# Altium schematic sheet ADF_1st_mixer_TX.SchDoc
size A4
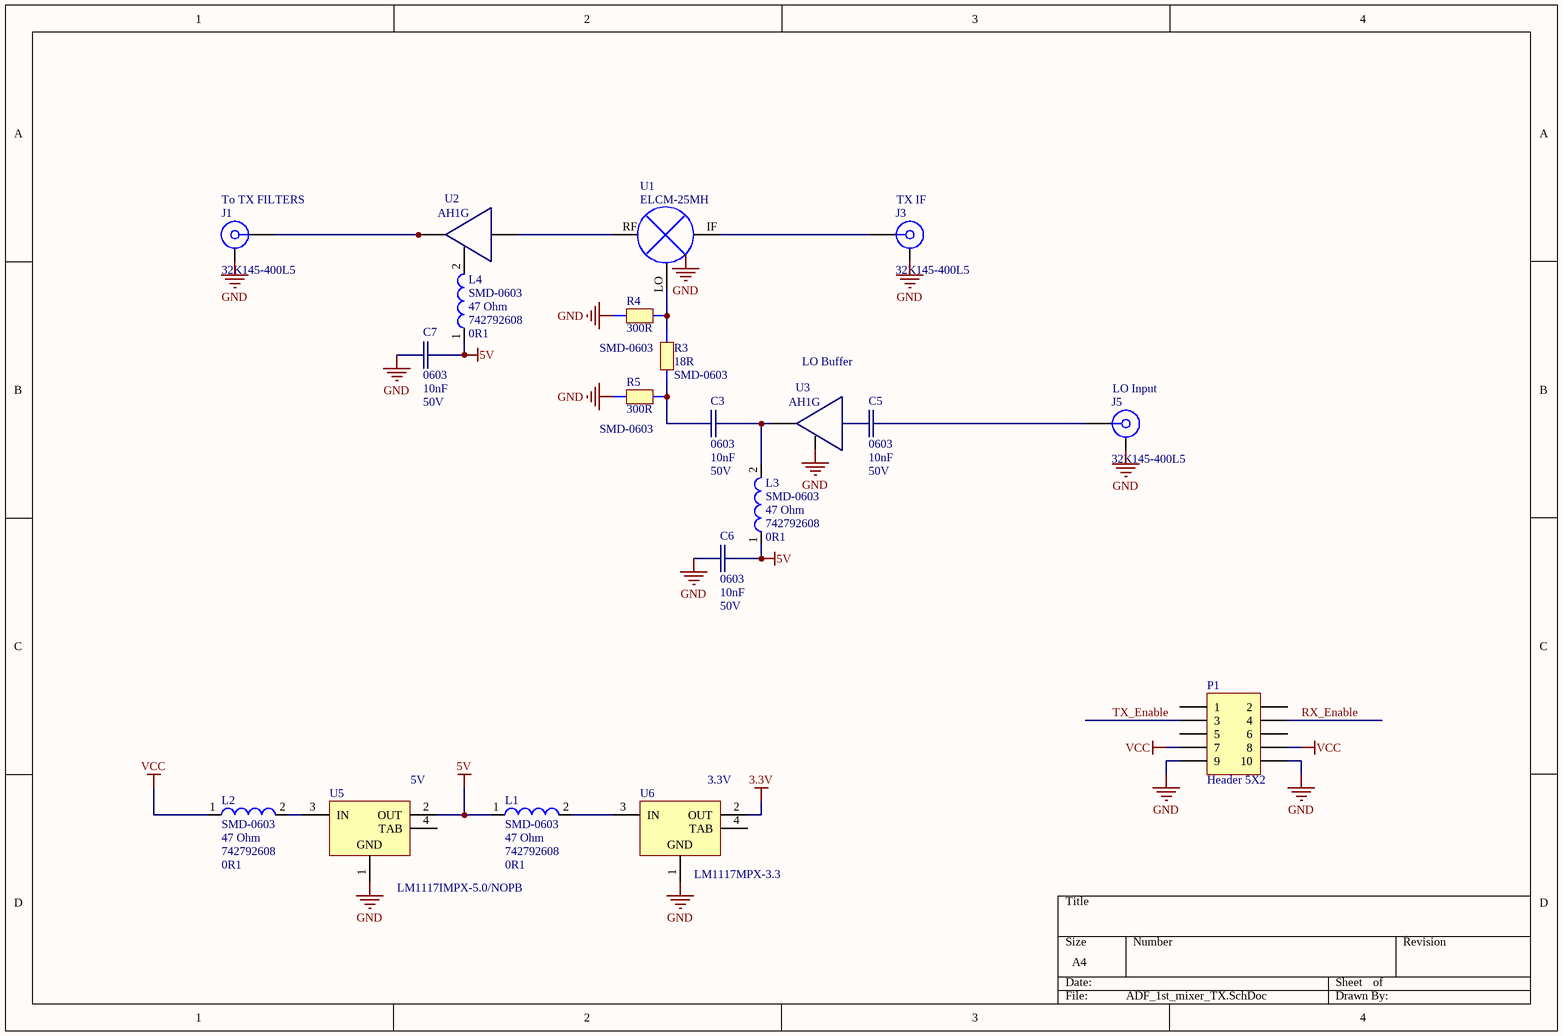
[diagram p0: ADF_1st_mixer_TX.SchDoc]

## Parts
C3  Case Code (Imperial): 0603  Capacitance: 10nF  Voltage: 50V  [C0603_murata]  (hidden comment: 10nF 0603 NP0)
C5  Case Code (Imperial): 0603  Capacitance: 10nF  Voltage: 50V  [C0603_murata]  (hidden comment: 10nF 0603 NP0)
C6  Case Code (Imperial): 0603  Capacitance: 10nF  Voltage: 50V  [C0603_murata]  (hidden comment: 10nF 0603 NP0)
C7  Case Code (Imperial): 0603  Capacitance: 10nF  Voltage: 50V  [C0603_murata]  (hidden comment: 10nF 0603 NP0)
J1  32K145-400L5  [ROS-32K145-400L5_V]
J3  32K145-400L5  [ROS-32K145-400L5_V]
J5  32K145-400L5  [ROS-32K145-400L5_V]
L1  Impedance: 47 Ohm  DC_Resistance: 0R1  [SMD-0603]  (hidden comment: 742792608)
L2  Impedance: 47 Ohm  DC_Resistance: 0R1  [SMD-0603]  (hidden comment: 742792608)
L3  Impedance: 47 Ohm  DC_Resistance: 0R1  [SMD-0603]  (hidden comment: 742792608)
L4  Impedance: 47 Ohm  DC_Resistance: 0R1  [SMD-0603]  (hidden comment: 742792608)
P1  Header 5X2  [HDR2X5]
R3  value 18R  PackageReference: SMD-0603  [RESC1608X06N_0603]  (hidden comment: Resistor)
R4  value 300R  PackageReference: SMD-0603  [RESC1608X06N_0603]  (hidden comment: Resistor)
R5  value 300R  PackageReference: SMD-0603  [RESC1608X06N_0603]  (hidden comment: Resistor)
U1  ELCM-25MH  [SM-87]
U2  AH1G  [SOT-89]
U3  AH1G  [SOT-89]
U5  LM1117IMPX-5.0/NOPB  [MP04A_M]
U6  LM1117MPX-3.3  [DCY0004A_N]

## Nets
3.3V: U6.2(OUT)
5V: C6.2 C7.2 L1.1 L3.1 L4.1 U5.2(OUT)
GND: C6.1 C7.1 J1.MP J3.MP J5.MP P1.9 P1.10 R4.2 R5.2 U1.GND U3.2 U5.1(GND) U6.1(GND)
VCC: L2.1 P1.7 P1.8
RX_Enable: P1.4
TX_Enable: P1.3
NetC3_1: C3.1 R3.1 R5.1
NetC3_2: C3.2 L3.2 U3.3
NetC5_1: C5.1 U3.1
NetC5_2: C5.2 J5.1
NetJ1_1: J1.1 U2.3
NetJ3_1: J3.1 U1.IF
NetL1_2: L1.2 U6.3(IN)
NetL2_2: L2.2 U5.3(IN)
NetL4_2: L4.2 U2.2
NetR3_2: R3.2 R4.1 U1.LO

Not connected (* = marked no-connect by the designer): P1 1 2 5 6; U1 RF; U2 1; U5 4(TAB); U6 4(TAB)

## Notes on the sheet
- (near J1) To TX FILTERS
- (near J3) TX IF
- LO Buffer
- (near J5) LO Input
- (near U5) 5V
- (near U6) 3.3V

## Library data of the parts
C3 C5-C7 = 10nF 0603 NP0: 10nF 0603 NP0 muRata; Manufacturer Part Number 1: GRM1885C1H103JA01D; Material: Ceramic; Tolerance: 5%; Dielectric: C0G; Supplier 1: Mouser; Manufacturer 1: Murata; Stock 1: 5; Pricing 1: 1=0.13, 10=0.05, 50=0.05, 100=0.035, 1000=0.024, 10000=0.016 (USD); Case/Package: 0603; Case Code (Metric): 1608; Min Operating Temperature: -55°C; Max Operating Temperature: 125°C; Packaging: Tape and Reel; Package Quantity: 4000; Voltage Rating: 50V; Voltage Rating (DC): 50V; Termination: SMD/SMT; Length: 1.6mm; Height: 0.8mm; Width: 0.8mm; Thickness: 0.035inch; Lead Pitch: 0.5mm; Depth: 0.8mm; REACH SVHC: No SVHC; Lead Free: Lead Free; ComponentLink1URL: https://datasheet.ciiva.com/41860/partnumbering-e-01-41860759.pdf; ComponentLink1Description: https://datasheet.ciiva.com/41860/partnumbering-e-01-41860759.pdf; ComponentLink2URL: https://datasheet.ciiva.com/29537/partnumbering-e-01-29537910.pdf; ComponentLink2Description: https://datasheet.ciiva.com/29537/partnumbering-e-01-29537910.pdf; Supplier Part Number 1: 81-GRM1885C1H103JA1D
J1 J3 J5 = 32K145-400L5: SMA Right Angle Jack, Edge Mount, Up to 18 GHz, -55 to 155 degC; Design Note 1: Footprint in library is a generic example - only application specific footprint delivers High Performance; Desgin Note 2: For more information about DRC setting, please look at following webpage, http://techdocs.altium.com/display/SCRT/Design+Rule+for+Edge-Mount+Connectors; DatasheetVersion: b00; PackageVersion: b00; PackageReference: 32K145-400L5; PackageDescription: SMA Right Angle Jack, Edge Mount, 14.25 x 9.5 x 4.46 mm; Mounting Technology: Surface Mount; PartNumber: 32K145-400L5; ComponentLink1Description: Manufacturer URL; ComponentLink1URL: http://www.rosenberger.de; ComponentLink2Description: Datasheet; ComponentLink2URL: http://rosenberger.de/ok/images/documents/db/32K145-400L5.pdf; ComponentLink3Description: Package Specification; ComponentLink3URL: http://rosenberger.de/ok/images/documents/db/32K145-400L5.pdf; ComponentLink4Description: Series Overview / Design Note; ComponentLink4URL: http://rosenberger.de/ok/images/documents/spez/32.pdf; ComponentLink5Description: Webshop / RFQ; ComponentLink5URL: http://www.rosenberger.com/en/contact/sales/
L1-L4 = 742792608: SMD EMI Suppression Ferrite Bead WE-CBF, Z = 47 Ohm; Seller: Farnell; OrderCode: 1635681RL; DatasheetVersion: Dec-2005; PackageVersion: 2009; PackageDescription: Chip Inductor, 2-Leads, Body 1.6 x 0.8 mm; ComponentLink1Description: Manufacturer URL; ComponentLink1URL: http://www.we-online.com; ComponentLink2Description: Datasheet; ComponentLink2URL: http://www.we-online.de/katalog/media/pdf/742792608.pdf; PackageReference: SMD-0603; Value: 742792608
P1 = Header 5X2: Header, 5-Pin, Dual row; LatestRevisionDate: 17-Jul-2002; LatestRevisionNote: Re-released for DXP Platform.; Publisher: Altium Limited
R3-R5 = Resistor_0R_0603_Bulk: Bulk SMD Resistor; Manufacturer: PANASONIC; ManufacturerRef: ERJ3GEY0R00V; Seller: Farnell; Voltage: 75V; PowerRating: 100mW; OrderCode: 2059527RL; TemperatureCoeff: ± 200ppm/°C; Type: Thick Film; PriceEuro: 0.005; PackageDescription: SMD; Published: 15.5.2014; Publisher: atr; Tolerance: -
U1 = ELCM-25MH: Manufacturer 1: TE Connectivity MA-COM; Manufacturer Part Number 1: ELCM-25MHTR; LO Drive: +13dBm; RF Power: +9dBm; Supplier 1: Avnet; Stock 1: 0; ComponentLink1URL: http://www.macomtech.com/DataSheets/ELCM-25MH.pdf; ComponentLink1Description: http://www.macomtech.com/DataSheets/ELCM-25MH.pdf; Supplier Part Number 1: ELCM-25MH
U2 U3 = AH1G: 250-4000MHz MMIC; Manufacturer 1: TriQuint; Manufacturer Part Number 1: AH1; Frequency: 4GHz; Number of Channels: 1; Supply Voltage: 5V; Gain: 13.5dB; P1dB: +22dBm; Supplier 1: Newark; Stock 1: 0; Pricing 1: 1=37.74, 25=34.58, 50=32.12, 100=31.07, 250=30.01 (USD); Mount: Surface Mount; Case/Package: SOT-89; Radiation Hardening: No; ComponentLink1URL: https://www.verical.com/server-webapp/html/getDatasheet?partID=559390; ComponentLink1Description: https://www.verical.com/server-webapp/html/getDatasheet?partID=559390; Supplier Part Number 1: 15B6194
U5 = CMP-0062-01628-3: 800mA Low-Dropout Linear Regulator, 4-pin SOT-223, Pb-Free; Manufacturer: National Semiconductor; CompType: LDO IC; High-Reliability: Y; PackageTopMarking: XYTT*N06B; PowerWise: N; ComponentLink3Description: LM1117 Web Page; ComponentLink3URL: http://www.national.com/pf/LM/LM1117.html; DatasheetVersion: Apr-2006; ComponentLink2Description: LM1117 Datasheet; PackageVersion: revB, Apr-2003; ComponentLink4Description: MP04A Package Page; ComponentLink1Description: Manufacturer URL; PartNumber: LM1117IMPX-5.0/NOPB; ComponentLink1URL: http://www.national.com/; PackageReference: MP04A; ComponentLink2URL: http://www.national.com/ds/LM/LM1117.pdf; PinCount: 4; Code_JEDEC: TO-261-AA; RevisionNote: SCH symbol layout adjusted; ComponentLink4URL: http://www.national.com/packaging/folders/mp04a.html; RoHS: Y; Code_IPC: SOT223-4; PackageDescription: Molded SOT-223, 6.50 x 3.56 x 1.6mm Body, 4 Lead, 2.3mm Pitch
U6 = CMP-0062-01659-4: 800mA Low-Dropout Linear Regulator, 4-pin SOT-223; Manufacturer: Texas Instruments; PackageTopMarking: XYTT*N05A; High-Reliability: Y; PowerWise: N; CompType: LDO IC; PackageDescription: Molded SOT-223, 6.50 x 3.56 x 1.6mm Body, 4 Lead, 2.3mm Pitch; PackageReference: DCY0004A; ComponentLink1Description: Datasheet URL; PartNumber: LM1117MPX-3.3; RoHS: N; PinCount: 4; Code_IPC: SOT223-4; Code_JEDEC: TO-261-AA; ComponentLink1URL: http://www.ti.com/general/docs/lit/getliterature.tsp?genericPartNumber=LM1117-N&fileType=pdf